# EAGLE design IN-12 Module (EAGLE 7.7.0)
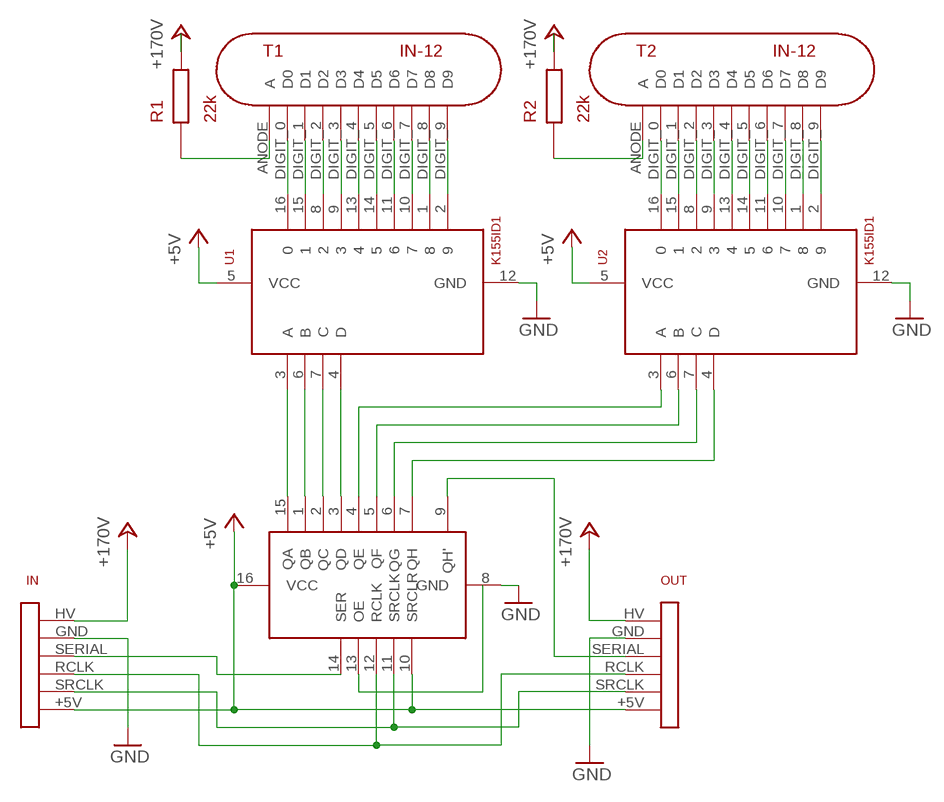
[diagram p0: schematic, sheet 1]

## Parts
IN  NIXIE_INTERCONNECT  [NIXIE_INTERCONNECT]
OUT  NIXIE_INTERCONNECT  [NIXIE_INTERCONNECT]
R1  22k  ANODE_RESISTOR  [ANODE_RESISTOR]
R2  22k  ANODE_RESISTOR  [ANODE_RESISTOR]
T1  IN-12  [IN-12]
T2  IN-12  [IN-12]
U1  K155ID1  [DIP16-2.54-19.2X7.62MM]
U2  K155ID1  [DIP16-2.54-19.2X7.62MM]
U3  74HC595  [DIL16]

## Nets
+5V: IN.+5V OUT.+5V U1.5(VCC) U2.5(VCC) U3.10(SRCLR) U3.16(VCC)
+24V: IN.HV OUT.HV R1.P$2 R2.P$2 ; supply symbol labelled +170V
GND: IN.GND OUT.GND U1.12(GND) U2.12(GND) U3.8(GND)
N$1: R1.P$1 T1.ANODE(A)
N$2: T1.DIGIT_0(D0) U1.16
N$3: T1.DIGIT_1(D1) U1.15
N$4: T1.DIGIT_2(D2) U1.8
N$5: T1.DIGIT_3(D3) U1.9
N$6: T1.DIGIT_4(D4) U1.13
N$7: T1.DIGIT_5(D5) U1.14
N$8: T1.DIGIT_6(D6) U1.11
N$9: T1.DIGIT_7(D7) U1.10
N$10: T1.DIGIT_8(D8) U1.1
N$11: T1.DIGIT_9(D9) U1.2
N$12: R2.P$1 T2.ANODE(A)
N$13: T2.DIGIT_0(D0) U2.16
N$14: T2.DIGIT_1(D1) U2.15
N$15: T2.DIGIT_2(D2) U2.8
N$16: T2.DIGIT_3(D3) U2.9
N$17: T2.DIGIT_4(D4) U2.13
N$18: T2.DIGIT_5(D5) U2.14
N$19: T2.DIGIT_6(D6) U2.11
N$20: T2.DIGIT_7(D7) U2.10
N$21: T2.DIGIT_8(D8) U2.1
N$22: T2.DIGIT_9(D9) U2.2
N$25: OUT.SERIAL U3.9(QH')
N$26: IN.SERIAL U3.14(SER)
N$27: IN.RCLK OUT.RCLK U3.12(RCLK)
N$29: IN.SRCLK OUT.SRCLK U3.11(SRCLK)
N$45: U3.13(OE)
N$67: U1.3(A) U3.15(QA)
N$68: U1.6(B) U3.1(QB)
N$69: U1.7(C) U3.2(QC)
N$70: U1.4(D) U3.3(QD)
N$71: U2.3(A) U3.4(QE)
N$72: U2.6(B) U3.5(QF)
N$73: U2.7(C) U3.6(QG)
N$74: U2.4(D) U3.7(QH)

## Library data of the parts
IN OUT = TimeExpander:NIXIE_INTERCONNECT
R1 R2 = TimeExpander:ANODE_RESISTOR: Anode resistor (Value is depending on drive voltage)
T1 T2 = TimeExpander:IN-12: Soviet IN-12 Nixie
U1 U2 = TimeExpander:K155ID1: Soviet version of SN74141 BCD to Decimal Decoder / Nixie Driver
U3 = TimeExpander:74HC595: 8-Bit Shift Register

## Board
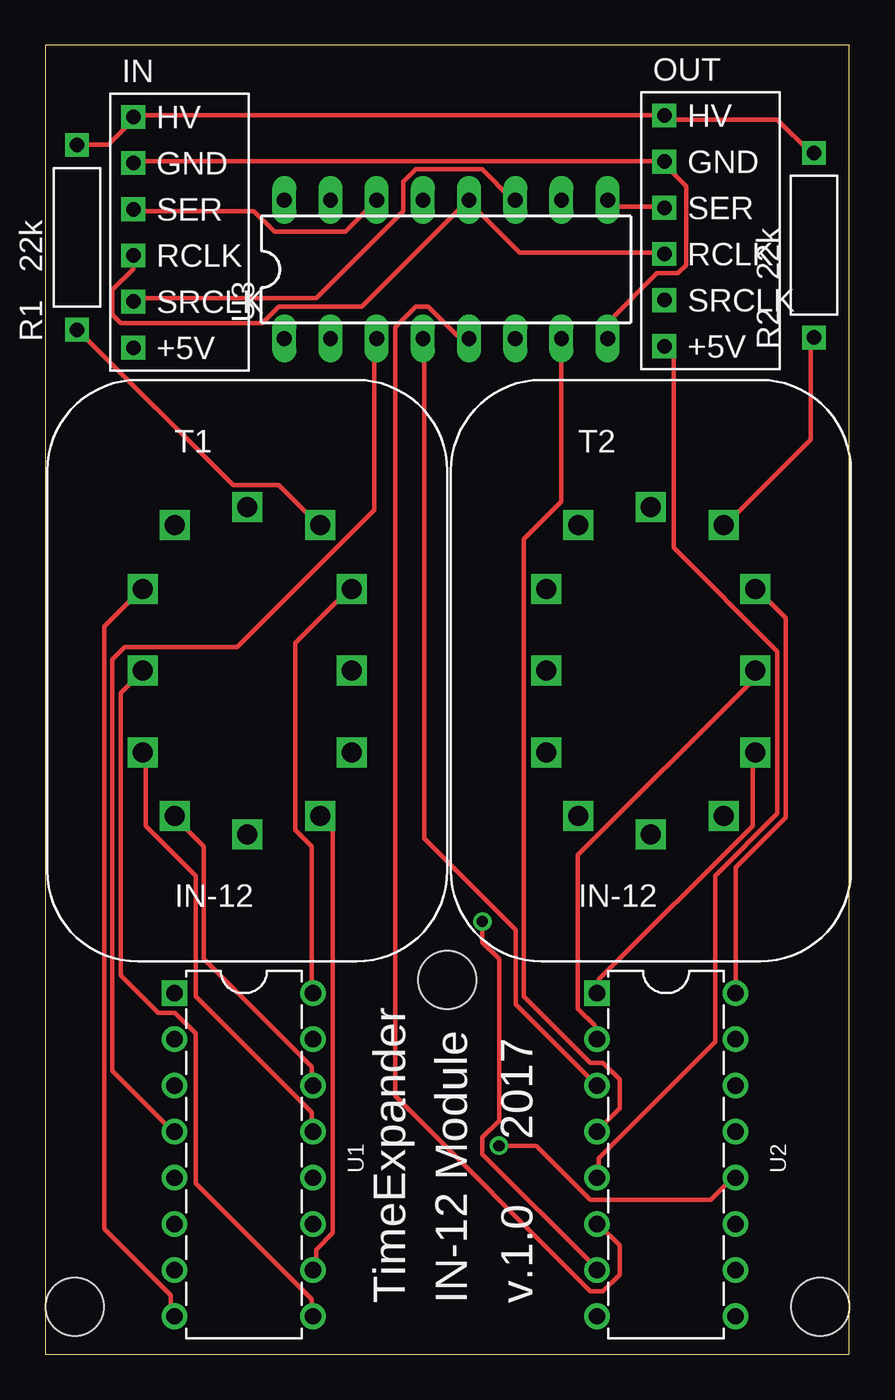
[diagram p1: board, top side]
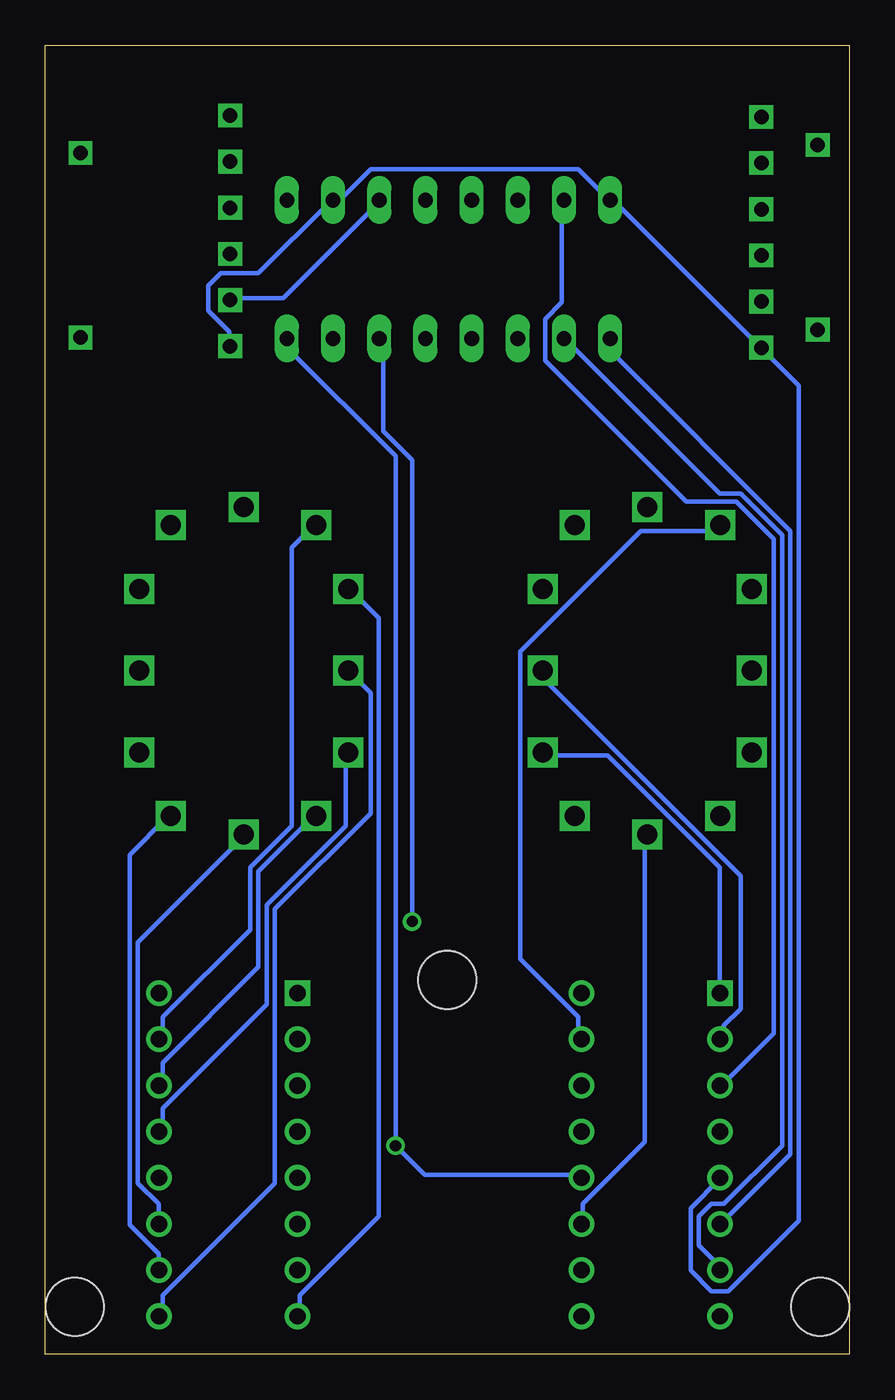
[diagram p2: board, bottom side, seen from below]

Size 44.2 x 72 mm. Coordinates in mm from the lower left corner, seen from the top.
Outline: 0,0 44.2,0 44.2,72 0,72 0,0
Copper layers (1*16): Top 0.035mm / dielectric 1.5mm / Bottom 0.035mm
Design rules "default": minimum track width 10mil, minimum drill 24mil, track to track 8mil, track to pad 8mil, pad to pad 8mil, via to via 8mil, smd to smd 8mil, copper to edge 40mil, drill to drill 8mil, minimum pad ring 10mil, minimum via ring 8mil, stop-mask expansion 4mil, vias tented up to drill 0mil, thermal gap 10mil
Holes 3.2 mm at 1.6,2.6 42.6,2.6 22.1,20.6

### Footprints (pad centres in the part's own frame; a part is rotated, then mirrored left to right if it is on the bottom)
NIXIE_INTERCONNECT = drill 0.8 square: +5V -10.16,-7.62; GND -10.16,2.54; HV -10.16,5.08; RCLK -10.16,-2.54; SERIAL -10.16,0; SRCLK -10.16,-5.08
ANODE_RESISTOR = drill 0.8 square: P$1 0,0; P$2 10.16,0
IN-12 = drill 1.1 square: ANODE 4,8; DIGIT_0 5.75,4.5; DIGIT_1 -4,8; DIGIT_2 -5.75,4.5; DIGIT_3 -5.75,0; DIGIT_4 -5.75,-4.5; DIGIT_5 -4,-8; DIGIT_6 0,-9; DIGIT_7 4,-8; DIGIT_8 5.75,-4.5; DIGIT_9 5.75,0; NC 0,9
DIP16-2.54-19.2X7.62MM = drill 0.9 pad 1.4 square: 1 -8.89,-3.81 | drill 0.9 pad 1.4: 2 -6.35,-3.81; 3 -3.81,-3.81; 4 -1.27,-3.81; 5 1.27,-3.81; 6 3.81,-3.81; 7 6.35,-3.81; 8 8.89,-3.81; 9 8.89,3.81; 10 6.35,3.81; 11 3.81,3.81; 12 1.27,3.81; 13 -1.27,3.81; 14 -3.81,3.81; 15 -6.35,3.81; 16 -8.89,3.81
DIL16 = drill 0.813 long: 1 -8.89,-3.81; 2 -6.35,-3.81; 3 -3.81,-3.81; 4 -1.27,-3.81; 5 1.27,-3.81; 6 3.81,-3.81; 7 6.35,-3.81; 8 8.89,-3.81; 9 8.89,3.81; 10 6.35,3.81; 11 3.81,3.81; 12 1.27,3.81; 13 -1.27,3.81; 14 -3.81,3.81; 15 -6.35,3.81; 16 -8.89,3.81

### Placement (x,y rotation side)
IN  14.99,62.99 0 top
OUT  44.2,63.07 0 top
R1  1.73,56.36 90 top
R2  42.27,55.93 90 top
T1  11.1,37.6 0 top
T2  33.3,37.6 0 top
U1  10.91,10.97 270 top
U2  34.14,10.97 270 top
U3  22.03,59.68 0 top

### Tracks (layer width: path | path; a pad name or v marks a point on that pad's centre or on a via)
+5V
  Top 0.254: U2.5 30.43,9.86 30.43,10.77 36.83,17.17 36.83,26.32 40.26,29.75 40.26,38.66 34.55,44.38 34.55,54.89 34.09,55.35 OUT.+5V
  Bottom 0.254: OUT.+5V 34.09,55.58 34.09,56.26 35.23,57.41 35.23,58.78 34.55,59.46 32.49,59.46 28.6,63.35 U3.10 28.38,63.58 27.92,63.58 26.32,65.18 14.89,65.18 13.29,63.58 U3.16 13.06,63.58 5.06,55.58 IN.+5V 4.83,55.35 2.77,53.29 2.77,7.34 6.66,3.46 7.57,3.46 8.71,4.6 8.71,8.03 7.12,9.63 U1.5
+24V
  Top 0.254: R1.P$2 1.86,66.55 3.46,66.55 4.83,67.92 IN.HV 5.06,68.15 33.86,68.15 OUT.HV 34.09,67.92 40.26,67.92 42.09,66.09 R2.P$2
GND  (via drill 0.61)
  Top 0.254: v24.95,11.46 27,11.46 29.98,8.49 36.6,8.49 37.75,9.63 U2.12 | IN.GND 5.06,65.64 33.86,65.64 OUT.GND 34.09,65.41 35.23,64.27 35.23,59.92 34.78,59.46 33.63,59.46 31.12,56.95 31.12,56.04 U3.8
  Bottom 0.254: U1.12 14.89,9.86 23.35,9.86 v24.95,11.46 24.95,49.41 30.89,55.35 30.89,55.81 U3.8
N$1
  Top 0.254: R1.P$1 1.86,56.26 10.32,47.81 12.83,47.81 14.89,45.75 T1.ANODE
N$2
  Top 0.254: U1.16 14.66,19.92 14.66,27.92 13.75,28.83 13.75,39.12 16.72,42.09 T1.DIGIT_0
N$3
  Bottom 0.254: U1.15 14.89,17.4 14.89,18.55 18.09,21.75 18.09,38.66 11.46,45.29 7.34,45.29 7.12,45.52 T1.DIGIT_1
N$4
  Top 0.254: U1.8 6.89,2.09 6.89,3.23 3.23,6.89 3.23,40.03 5.29,42.09 T1.DIGIT_2
N$5
  Top 0.254: U1.9 14.66,2.09 14.66,3 8.26,9.4 8.26,17.63 7.12,18.77 6.2,18.77 4.14,20.83 4.14,36.38 5.29,37.52 T1.DIGIT_3
N$6
  Top 0.254: U1.13 14.66,12.37 14.66,13.29 8.26,19.69 8.26,26.32 5.51,29.06 5.51,32.95 T1.DIGIT_4
N$7
  Top 0.254: U1.14 14.66,14.89 14.66,15.8 8.71,21.75 8.71,27.92 7.12,29.52 T1.DIGIT_5
N$8
  Bottom 0.254: U1.11 14.66,7.34 14.66,8.26 11.23,11.69 11.23,28.38 T1.DIGIT_6
N$9
  Top 0.254: U1.10 14.89,4.83 14.89,5.74 15.8,6.66 15.8,28.83 15.12,29.52 T1.DIGIT_7
N$10
  Bottom 0.254: U1.1 7.12,19.92 7.12,26.78 13.29,32.95 16.72,32.95 T1.DIGIT_8
N$11
  Bottom 0.254: U1.2 6.89,17.4 6.89,18.09 5.97,19 5.97,26.32 16.72,37.06 16.72,37.52 T1.DIGIT_9
N$12
  Top 0.254: R2.P$1 42.09,55.81 42.09,50.32 37.52,45.75 T2.ANODE
N$13
  Top 0.254: U2.16 37.98,19.92 37.98,26.78 40.72,29.52 40.72,40.49 39.12,42.09 T2.DIGIT_0
N$14
  Bottom 0.254: U2.15 37.75,17.4 37.75,18.55 32.95,23.35 32.95,26.78 30.66,29.06 30.66,44.38 29.52,45.52 T2.DIGIT_1
N$15
  Bottom 0.254: U2.8 30.2,2.09 30.2,3.23 25.86,7.57 25.86,40.49 27.46,42.09 T2.DIGIT_2
N$16
  Bottom 0.254: U2.9 37.75,2.09 37.75,3.23 31.57,9.4 31.57,24.49 26.32,29.75 26.32,36.38 27.46,37.52 T2.DIGIT_3
N$17
  Bottom 0.254: U2.13 37.75,12.37 37.75,13.52 32.03,19.23 32.03,24.72 27.69,29.06 27.69,32.95 T2.DIGIT_4
N$18
  Bottom 0.254: U2.14 37.75,14.89 37.75,16.03 32.49,21.29 32.49,26.55 29.52,29.52 T2.DIGIT_5
N$19
  Bottom 0.254: U2.11 37.98,7.34 37.98,8.26 39.12,9.4 39.12,22.66 33.4,28.38 T2.DIGIT_6
N$20
  Bottom 0.254: U2.10 37.98,4.83 37.98,5.51 39.58,7.12 39.58,27.46 37.52,29.52 T2.DIGIT_7
N$21
  Top 0.254: U2.1 30.43,19.92 30.43,20.6 38.89,29.06 38.89,32.95 T2.DIGIT_8
N$22
  Top 0.254: U2.2 30.2,17.4 30.2,18.09 29.29,19 29.29,27.46 38.89,37.06 38.89,37.52 T2.DIGIT_9
N$25
  Top 0.254: OUT.SERIAL 33.86,63.12 31.35,63.12 31.12,63.35 U3.9
N$26
  Top 0.254: IN.SERIAL 5.06,62.89 11.46,62.89 12.6,61.75 16.49,61.75 18.09,63.35 U3.14
N$27
  Top 0.254: IN.RCLK 4.83,60.38 4.83,59.69 3.69,58.55 3.69,57.18 4.14,56.72 11.92,56.72 12.83,57.64 17.4,57.64 23.12,63.35 U3.12 23.35,63.35 26.09,60.61 33.86,60.61 OUT.RCLK
N$29
  Top 0.254: IN.SRCLK 5.06,58.09 14.89,58.09 19.69,62.89 19.69,64.49 20.37,65.18 24.03,65.18 25.63,63.58 U3.11
  Bottom 0.254: OUT.SRCLK 33.86,58.09 31.12,58.09 25.86,63.35 U3.11
N$67
  Bottom 0.254: U3.15 15.8,63.35 15.8,57.86 16.72,56.95 16.72,54.66 8.94,46.89 6.2,46.89 4.14,44.83 4.14,17.63 6.89,14.89 U1.3
N$68
  Bottom 0.254: U3.1 13.06,55.81 13.06,55.12 3.23,45.29 3.23,11 6.89,7.34 U1.6
N$69
  Bottom 0.254: U3.2 15.57,55.81 7.12,47.35 5.97,47.35 3.69,45.06 3.69,11.46 6.89,8.26 7.57,8.26 8.26,7.57 8.26,5.97 7.12,4.83 U1.7
N$70
  Top 0.254: U3.3 18.09,55.81 18.09,46.43 10.54,38.89 4.37,38.89 3.69,38.2 3.69,15.57 6.89,12.37 U1.4
N$71
  Top 0.254: U3.4 20.83,55.81 20.83,28.38 25.86,23.35 25.86,19.23 30.2,14.89 U2.3
N$72
  Top 0.254: U3.5 23.12,56.04 22.66,56.04 21.06,57.64 20.37,57.64 19.23,56.49 19.23,14.2 29.98,3.46 30.66,3.46 31.57,4.37 31.57,5.97 30.43,7.12 U2.6
N$73  (via drill 0.61)
  Top 0.254: v24.03,23.8 24.03,22.66 24.95,21.75 24.95,12.83 24.03,11.92 24.03,11 30.2,4.83 U2.7
  Bottom 0.254: v24.03,23.8 24.03,49.18 25.63,50.78 25.63,55.81 U3.6
N$74
  Top 0.254: U3.7 28.38,55.81 28.38,46.89 26.32,44.83 26.32,19.69 29.98,16.03 30.66,16.03 31.57,15.12 31.57,13.52 30.43,12.37 U2.4

### Text on the board
tPlace: 2017 | TimeExpander | IN-12 Module | v.1.0